# Altium schematic sheet PROC051D_Tempsensor.SchDoc: Tempsensor
size 431 x 279 mm; Date: Not shown in title block; ApprovedBy: Not shown in title block; CheckedBy: Not shown in title block; Author: Not shown in title block; CompanyName: Not shown in title block; Engineer: Not shown in title block; Organization: Not shown in title block; Address1: Not shown in title block; Address2: Not shown in title block; Address3: Not shown in title block; Address4: Not shown in title block; DocumentNumber: 15; Revision: Use project parameter SCH_Rev; SheetNumber: 15; SheetTotal: 16; PageSetup: Record=PageOptions|CenterHorizontal=True|CenterVertical=True|PrintScale=1.00|XCorrection=1.00|YCorrection=1.00|PrintKind=0|BorderSize=5000000|LeftOffset=0|BottomOffset=0|Orientation=2|PaperLength=1000|PaperWidth=1000|Scale=100|PaperSource=15|PrintQuality=600|MediaType=1|DitherType=10|PaperKind=Letter|PrintScaleMode=1; CurrentTime: Not shown in title block; CurrentDate: Not shown in title block; Time: Not shown in title block; DocumentFullPathAndName: Not shown in title block; DocumentName: Not shown in title block; ModifiedDate: Not shown in title block; ImagePath: Not shown in title block
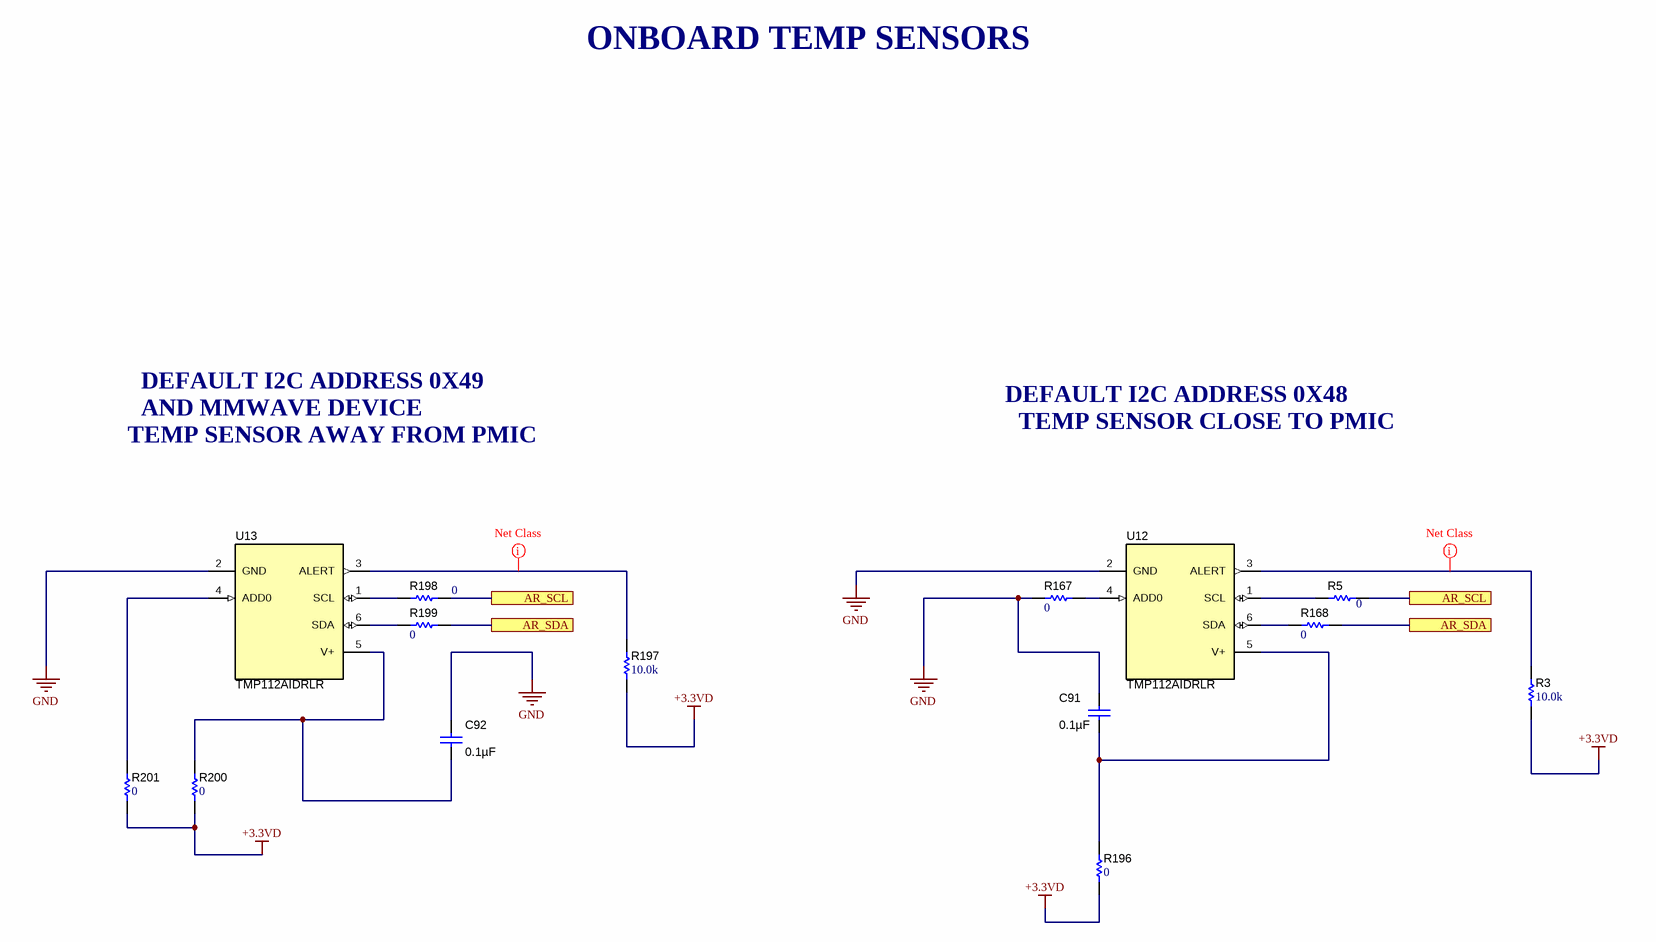
[diagram p0: PROC051D_Tempsensor.SchDoc]

## Parts
C91  ValueDisplayed: 0.1µF  [0402L]  (hidden comment: C0402C104K8RACTU)
C92  ValueDisplayed: 0.1µF  [0402L]  (hidden comment: C0402C104K8RACTU)
R3  ValueDisplayed: 10.0k  [0402L]  (hidden comment: CRCW040210K0FKED)
R5  ValueDisplayed: 0  [0201_Silk]  (hidden comment: CRCW02010000Z0ED)
R167  ValueDisplayed: 0  [0201_Silk]  (hidden comment: CRCW02010000Z0ED)
R168  ValueDisplayed: 0  [0201_Silk]  (hidden comment: CRCW02010000Z0ED)
R196  ValueDisplayed: 0  [0402L]  (hidden comment: ERJ-2GE0R00X)
R197  ValueDisplayed: 10.0k  [0402L]  (hidden comment: CRCW040210K0FKED)
R198  ValueDisplayed: 0  [0201_Silk]  (hidden comment: CRCW02010000Z0ED)
R199  ValueDisplayed: 0  [0201_Silk]  (hidden comment: CRCW02010000Z0ED)
R200  ValueDisplayed: 0  [0402L]  (hidden comment: ERJ-2GE0R00X)
R201  ValueDisplayed: 0  [0201_Silk]  (hidden comment: CRCW02010000Z0ED)
U12  TMP112AIDRLR  [DRL0006A]
U13  TMP112AIDRLR  [DRL0006A]

## Ports
AR_SCL, AR_SDA

## Nets
+3.3VD: R3.2 R196.2 R197.2 R200.2 R201.2
GND: C91.1 C92.1 R167.1 U12.2(GND) U13.2(GND)
AR_SCL: R5.1 R198.1 ; port AR_SCL
AR_SDA: R168.2 R199.2 ; port AR_SDA
NetC91_2: C91.2 R196.1 U12.5(V+)
NetC92_2: C92.2 R200.1 U13.5(V+)
NetR3_1: R3.1 U12.3(ALERT)
NetR5_2: R5.2 U12.1(SCL)
NetR167_2: R167.2 U12.4(ADD0)
NetR168_1: R168.1 U12.6(SDA)
NetR197_1: R197.1 U13.3(ALERT)
NetR198_2: R198.2 U13.1(SCL)
NetR199_1: R199.1 U13.6(SDA)
NetR201_1: R201.1 U13.4(ADD0)

## Layout directives
net class PWR: NetR3_1, NetR197_1

## Notes on the sheet
- ONBOARD TEMP SENSORS
- DEFAULT I2C ADDRESS 0X49
- DEFAULT I2C ADDRESS 0X48
- TEMP SENSOR AWAY FROM PMIC
- AND MMWAVE DEVICE
- TEMP SENSOR CLOSE TO PMIC
- Drawn By:
- SVN Rev:
- Number:
- TID #:
- Orderable:
- Rev:
- Sheet Title:
- File:
- Project Title:
- Designed for:
- Assembly Variant:
- Mod. Date:
- Sheet:
- Size:
- of
- B
- http://www.ti.com
- Texas Instruments and/or its licensors do not warrant the accuracy or completeness of this specification or any information contained therein. Texas Instruments and/or its licensors do not warrant that this design will meet the specifications, will be suitable for your application or fit for any particular purpose, or will operate in an implementation. Texas Instruments and/or its licensors do not warrant that the design is production worthy. You should completely validate and test your design implementation to confirm the system functionality for your application.
- Engineer:
- Contact:
- © Texas Instruments

## Library data of the parts
C91 C92 = CMP-0078241-1: CAP, CERM, 0.1 µF, 10 V,+/- 10%, X7R, 0402; Manufacturer: Kemet; TaMin_C: -55°C; Polarized: N; SizeAreaWB_mm2: 3; U/M: EA; Value: 0.1uF; TaMax_C: 125°C; SizeZ_mm: 0.6; SizeX_mm: 1; SizeY_mm: 0.5; Cap_Case: 0402; Value2: 10V; Cap_F: 100nF; AEC Category: Q200; ComponentLink1URL: https://content.kemet.com/datasheets/KEM_C1002_X7R_SMD.pdf; Supplier Part Number 2: 68X2393; Supplier 2: Newark; Supplier Part Number 3: 80-C0402C104K8R; TempCo: X7R; Supplier 3: Mouser; RoHS: Y; MountType: SMT; Supplier 1: Digi-Key; PackageReference: 0402; Tolerance_%: 10%; SizeArea_mm2: 0.5; CompType: Capacitor; PartNumber: C0402C104K8RACTU; AEC Qualified: N; VDC_V: 10V; ComponentLink1Description: Datasheet link; AEC Grade: N/A; Supplier Part Number 1: 399-3520-1-ND; Technology: Ceramic
R3 R197 = CMP-0025958-3: RES, 10.0 k, 1%, 0.063 W, AEC-Q200 Grade 0, 0402; Manufacturer: Vishay-Dale; Power_W: 63mW; TempCo: 100 ppm/C; Value_Code: 10k0; Value: 10.0k; EIA_Code: E96; Res_ohm: 10k; SizeX_mm: 1; SizeY_mm: 0.5; SizeZ_mm: 0.6; Value2: 0.063W; AEC Qualified: Y; VDC_V: 50V; AEC Category: Q200; AEC Grade: 0; Supplier Part Number 2: 52K6595; Supplier 2: Newark; Supplier Part Number 3: 71-CRCW0402-10K-E3; Supplier 3: Mouser; RoHS: E; Value1: 1%; MountType: SMT; Supplier 1: Digi-Key; PackageReference: 0402; Tolerance_%: 1%; SizeArea_mm2: 0.5; CompType: Resistor; PartNumber: CRCW040210K0FKED; ComponentLink1Description: Datasheet link; Supplier Part Number 1: 541-10.0KLCT-ND; Technology: Thick Film; ComponentLink1URL: http://www.vishay.com/docs/20035/dcrcwe3.pdf
R5 R167 R168 R198 R199 R201 = CMP-0027008-4: RES, 0, 5%, 0.05 W, 0201; Manufacturer: Vishay-Dale; Power_W: 50mW; TempCo: ppm/C; Value_Code: 0000; Value: 0; EIA_Code: E24; SizeX_mm: 0.6; SizeY_mm: 0.3; SizeZ_mm: 0.26; Value2: 0.05W; SizeArea_mm2: 0.18; AEC Qualified: N; AEC Category: Q200; RoHS: E; Value1: 5%; MountType: SMT; Supplier 1: Newark; PackageReference: 0201; Tolerance_%: 5%; Res_ohm: 0; CompType: Resistor; PartNumber: CRCW02010000Z0ED; ComponentLink1Description: Datasheet link; AEC Grade: N/A; Supplier Part Number 1: 72M6743; Technology: Thick Film; ComponentLink1URL: http://www.vishay.com/docs/20052/crcw0201e3.pdf
R196 R200 = CMP-0026992-3: RES, 0, 5%, 0.1 W, AEC-Q200 Grade 0, 0402; Manufacturer: Panasonic; Power_W: 100mW; TempCo: 600 ppm/C; Value_Code: 0000; Value: 0; EIA_Code: E24; SizeX_mm: 1; SizeY_mm: 0.5; SizeZ_mm: 0.6; Value2: 0.1W; AEC Qualified: Y; VDC_V: 50V; AEC Category: Q200; SizeAreaWB_mm2: 3; Supplier Part Number 2: 65T8307; Supplier 2: Newark; Supplier Part Number 3: 667-ERJ-2GE0R00X; Supplier 3: Mouser; RoHS: Y; Value1: 5%; MountType: SMT; Supplier 1: Digi-Key; PackageReference: 0402; Tolerance_%: 5%; Res_ohm: 0; SizeArea_mm2: 0.5; CompType: Resistor; PartNumber: ERJ-2GE0R00X; ComponentLink1Description: Datasheet link; Supplier Part Number 1: P0.0JCT-ND; Technology: Thick Film; ComponentLink1URL: https://industrial.panasonic.com/cdbs/www-data/pdf/RDA0000/AOA0000C301.pdf; AEC Grade: 0
U12 U13 = CMP-0067397-2: 1.4V-Capable +/-0.5degC Temperature Sensor with Alert Function and I2C/SMBus interface in SOT-563, DRL0006A (SOT-OTHER-6); Alternate PartNumber: TMP112AIDRLT; Alternate Manufacturer: Texas Instruments; Green_Lifecycle: Active; SizeAreaWB_mm2: 6.76; Green_REACh: Passed; U/M: EA; SizeZ_mm: 0.6; SizeX_mm: 1.6; SizeArea_mm2: 2.56; CompType: IC; ComponentLink1URL: http://www.ti.com/lit/ds/symlink/tmp112.pdf; Publisher: Texas Instruments; PackageDescription: SOT-OTHER-6; RoHS: Y; MountType: SMT; Green_EU RoHS-2: Passed; Manufacturer: Texas Instruments; Green_EU RoHS: Passed; PackageReference: DRL0006A; SizeY_mm: 1.6; LatestRevisionDate: 2017-06-09; PartNumber: TMP112AIDRLR; ComponentLink1Description: Datasheet Link